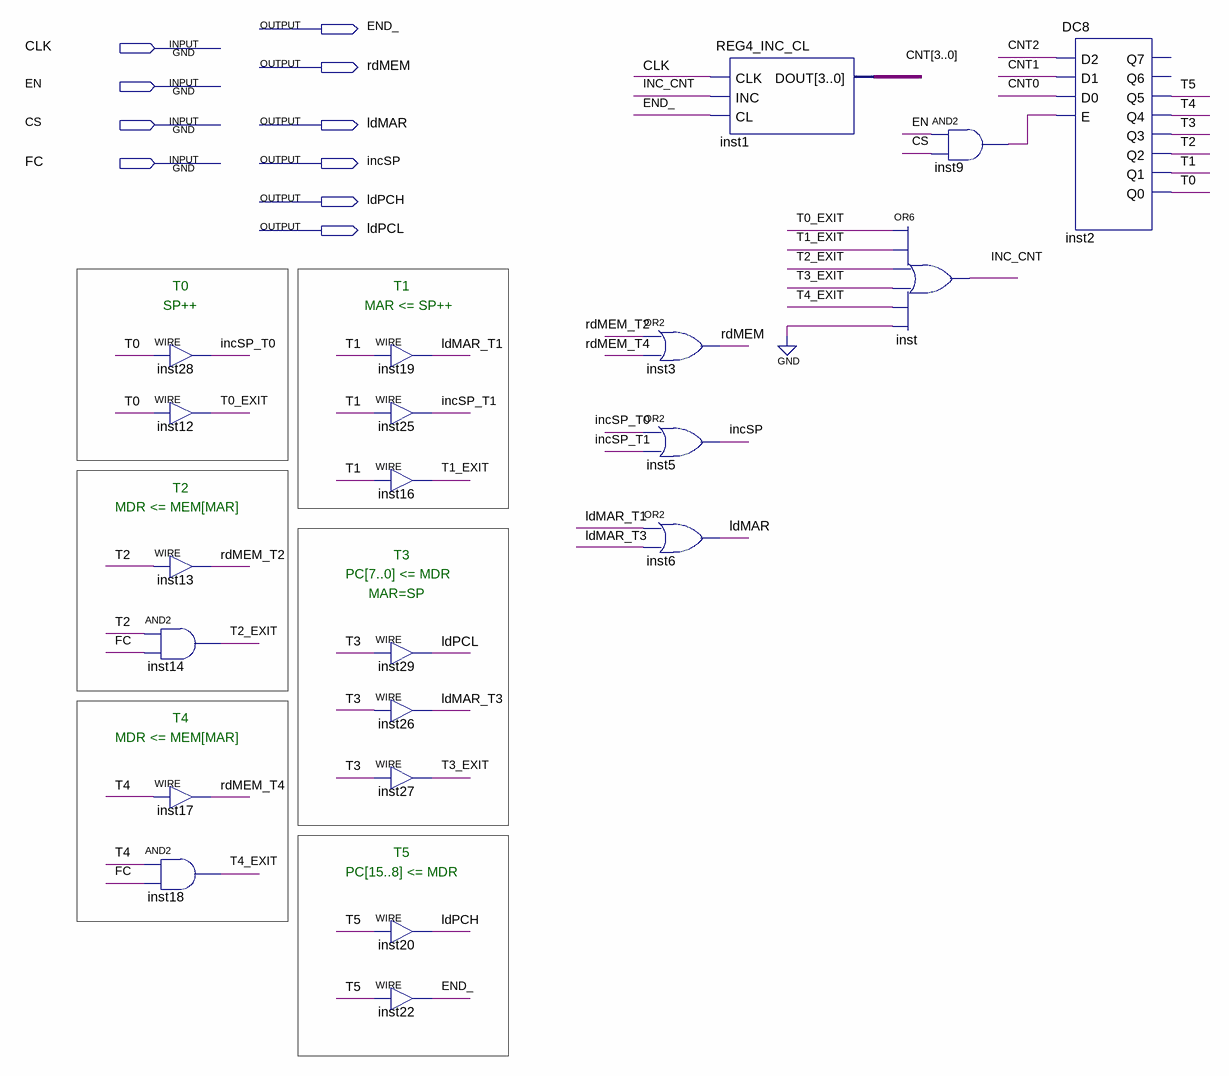
[diagram p0: schematic sheet]
// Quartus schematic RTS.bdf as structural Verilog: 21 symbols, 10 pins
module RTS (
  input  CLK,
  input  EN,
  input  CS,
  input  FC,
  output END_,
  output rdMEM,
  output ldMAR,
  output incSP,
  output ldPCH,
  output ldPCL
);

  wire INC_CNT, incSP_T0, incSP_T1, inst9_out, ldMAR_T1, ldMAR_T3, rdMEM_T2, rdMEM_T4, T0, T0_EXIT, T1,
       T1_EXIT, T2, T2_EXIT, T3, T3_EXIT, T4, T4_EXIT, T5;
  wire [3:0] CNT;

  and inst14 (T2_EXIT, T2, FC);
  and inst18 (T4_EXIT, T4, FC);
  assign incSP_T0 = T0;  // WIRE inst28
  assign T0_EXIT = T0;  // WIRE inst12
  assign rdMEM_T2 = T2;  // WIRE inst13
  assign rdMEM_T4 = T4;  // WIRE inst17
  assign ldMAR_T1 = T1;  // WIRE inst19
  assign incSP_T1 = T1;  // WIRE inst25
  assign T1_EXIT = T1;  // WIRE inst16
  assign ldPCL = T3;  // WIRE inst29
  assign ldMAR_T3 = T3;  // WIRE inst26
  assign T3_EXIT = T3;  // WIRE inst27
  assign ldPCH = T5;  // WIRE inst20
  assign END_ = T5;  // WIRE inst22
  or inst3 (rdMEM, rdMEM_T2, rdMEM_T4);
  or inst5 (incSP, incSP_T0, incSP_T1);
  or inst6 (ldMAR, ldMAR_T1, ldMAR_T3);
  REG4_INC_CL inst1 (.CLK(CLK), .INC(INC_CNT), .CL(END_), .DOUT(CNT));
  or inst (INC_CNT, T0_EXIT, T1_EXIT, T2_EXIT, T3_EXIT, T4_EXIT, 1'b0);
  and inst9 (inst9_out, EN, CS);
  DC8 inst2 (
    .D2(CNT[2]), .D1(CNT[1]), .D0(CNT[0]), .E(inst9_out), .Q5(T5), .Q4(T4), .Q3(T3), .Q2(T2), .Q1(T1), .Q0(T0));  // open: Q7, Q6

  // Notes on the sheet:
  //   T0
  //   T1
  //   SP++
  //   MAR <= SP++
  //   T2
  //   MDR <= MEM[MAR] 
  //   T3
  //   PC[7..0] <= MDR
  //    MAR=SP
  //   T4
  //   MDR <= MEM[MAR] 
  //   T5
  //   PC[15..8] <= MDR
endmodule
